# EAGLE design Tarjeta_RS232_M-PIC (EAGLE 5.06)
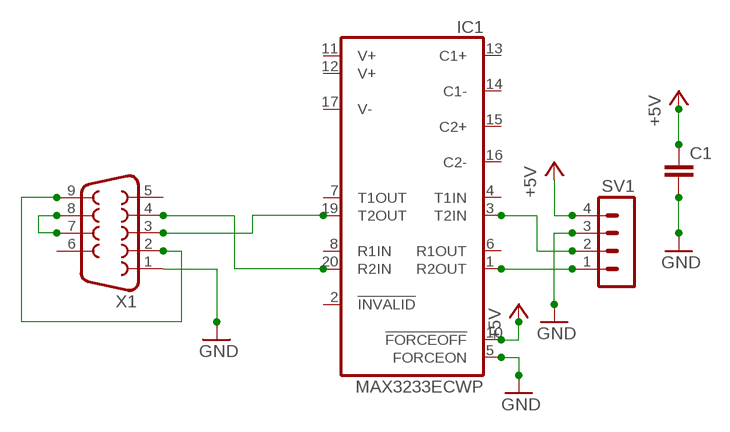
[diagram p0: schematic, sheet 1]

## Parts
C1  C-EUC1206  [C1206]
IC1  MAX3233ECWP  [SO20L]
SV1  MA04-1  [MA04-1]
X1  F09D  [F09D]

## Nets
+5V: C1.1 IC1.10(!FORCEOFF) SV1.4
GND: C1.2 IC1.5(FORCEON) SV1.3 X1.1
N$1: X1.7 X1.8
N$2: X1.2 X1.9
N$4: IC1.1(R2OUT) SV1.1
N$5: IC1.19(T2OUT) X1.3
N$6: IC1.3(T2IN) SV1.2
N$8: IC1.20(R2IN) X1.4
Unconnected: IC1.2(!INVALID) IC1.4(T1IN) IC1.6(R1OUT) IC1.7(T1OUT) IC1.8(R1IN) IC1.11(V+) IC1.12(V+) IC1.13(C1+) IC1.14(C1-) IC1.15(C2+) IC1.16(C2-) IC1.17(V-) X1.5 X1.6

## Power pins joined to a net without a drawn wire
GND: IC1.18(GND)
VCC: IC1.9(VCC)

## Library data of the parts
C1 = rcl:C-EU: CAPACITOR, European symbol
IC1 = maxim:MAX3233E: Dual RS-232 Transceivers with Internal Capacitors ±15kV ESD-Protected, 1µA, 250kbps, 3.3V/5V Source: http://datasheets.maxim-ic.com/en/ds/MAX3233E-MAX3235E.pdf
SV1 = con-lstb:MA04-1: PIN HEADER
X1 = con-subd:F09: SUB-D

## Board
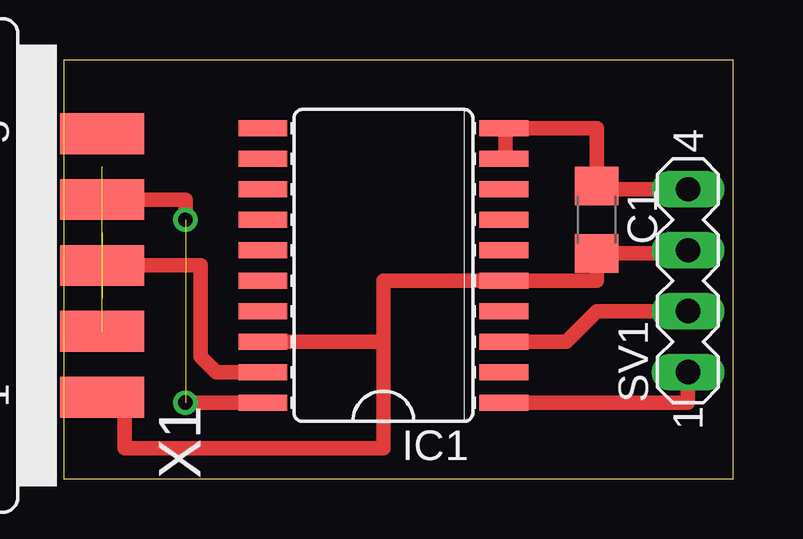
[diagram p1: board, top side]
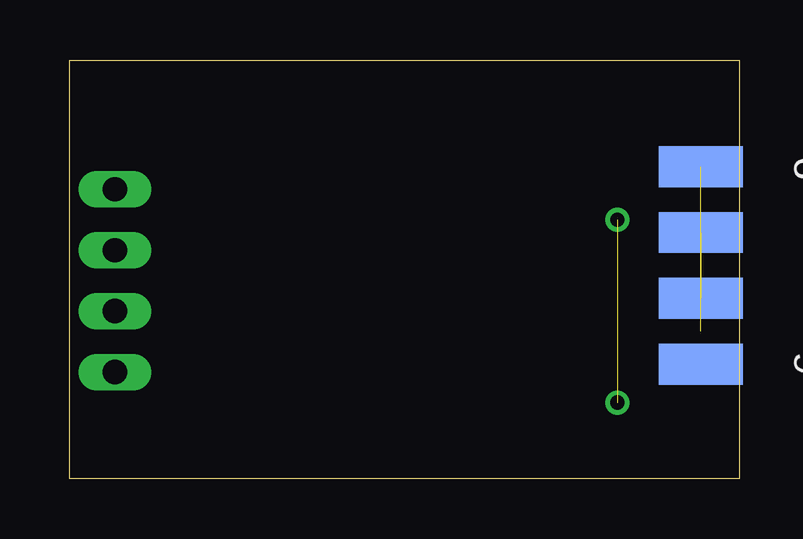
[diagram p2: board, bottom side, seen from below]

Size 27.92 x 17.45 mm. Coordinates in mm from the lower left corner, seen from the top.
Outline: 0,0 27.92,0 27.92,17.45 0,17.45 0,0
Copper layers (1*16): Top 0.035mm / dielectric 1.5mm / Bottom 0.035mm
Design rules "default": minimum track width 10mil, minimum drill 24mil, track to track 8mil, track to pad 8mil, pad to pad 8mil, via to via 8mil, smd to smd 8mil, copper to edge 40mil, drill to drill 8mil, minimum pad ring 10mil, minimum via ring 8mil, stop-mask expansion 4mil, vias tented up to drill 0mil, thermal gap 10mil

### Footprints (pad centres in the part's own frame; a part is rotated, then mirrored left to right if it is on the bottom)
C1206 = smd 1.6 x 1.8: 1 -1.4,0; 2 1.4,0
SO20L = smd 0.66 x 2.032: 1 -5.715,-5.029; 2 -4.445,-5.029; 3 -3.175,-5.029; 4 -1.905,-5.029; 5 -0.635,-5.029; 6 0.635,-5.029; 7 1.905,-5.029; 8 3.175,-5.029; 9 4.445,-5.029; 10 5.715,-5.029; 11 5.715,5.029; 12 4.445,5.029; 13 3.175,5.029; 14 1.905,5.029; 15 0.635,5.029; 16 -0.635,5.029; 17 -1.905,5.029; 18 -3.175,5.029; 19 -4.445,5.029; 20 -5.715,5.029
MA04-1 = drill 1.016 long: 1 -3.81,0; 2 -1.27,0; 3 1.27,0; 4 3.81,0
F09D = smd 1.7 x 3.5: 1 -5.486,-6.045; 2 -2.743,-6.045; 3 0,-6.045; 4 2.743,-6.045; 5 5.486,-6.045 | smd 1.7 x 3.5 bottom: 6 -4.115,-6.045; 7 -1.372,-6.045; 8 1.372,-6.045; 9 4.115,-6.045

### Placement (x,y rotation side)
C1  22.23,10.8 270 top
IC1  13.34,8.89 90 top
SV1  26.04,8.26 90 top
X1  -4.45,8.89 90 top

### Tracks (layer width: path | path; a pad name or v marks a point on that pad's centre or on a via)
+5V
  Top 0.61: SV1.4 22.23,12.07 C1.1 22.23,14.61 18.41,14.61 | 18.41,14.61 IC1.10 | 18.41,14.61 18.41,13.34
GND
  Top 0.61: SV1.3 26.04,9.4 C1.2 22.23,8.26 IC1.5 13.34,8.26 13.34,5.72 | X1.1 2.54,3.4 2.54,1.27 13.34,1.27 13.34,5.72 | 13.34,5.72 IC1.18
N$1  (1 unrouted)
N$2  (1 unrouted)
N$3  (via drill 0.6)
  other vias: 5.08,10.8
N$4
  Top 0.61: IC1.1 26.04,3.18 SV1.1
N$5
  Top 0.61: IC1.19 6.35,4.45 5.71,5.08 5.71,8.89 X1.3
N$6
  Top 0.61: IC1.3 20.95,5.72 22.23,6.98 SV1.2
N$7  (via drill 0.6)
  other vias: 5.08,3.18
N$8  (1 unrouted)
  Top 0.61: 5.08,3.18 IC1.20 | X1.4 5.08,11.63 5.08,10.8